# EAGLE design dresden_breakout_v03c (EAGLE 5.10)
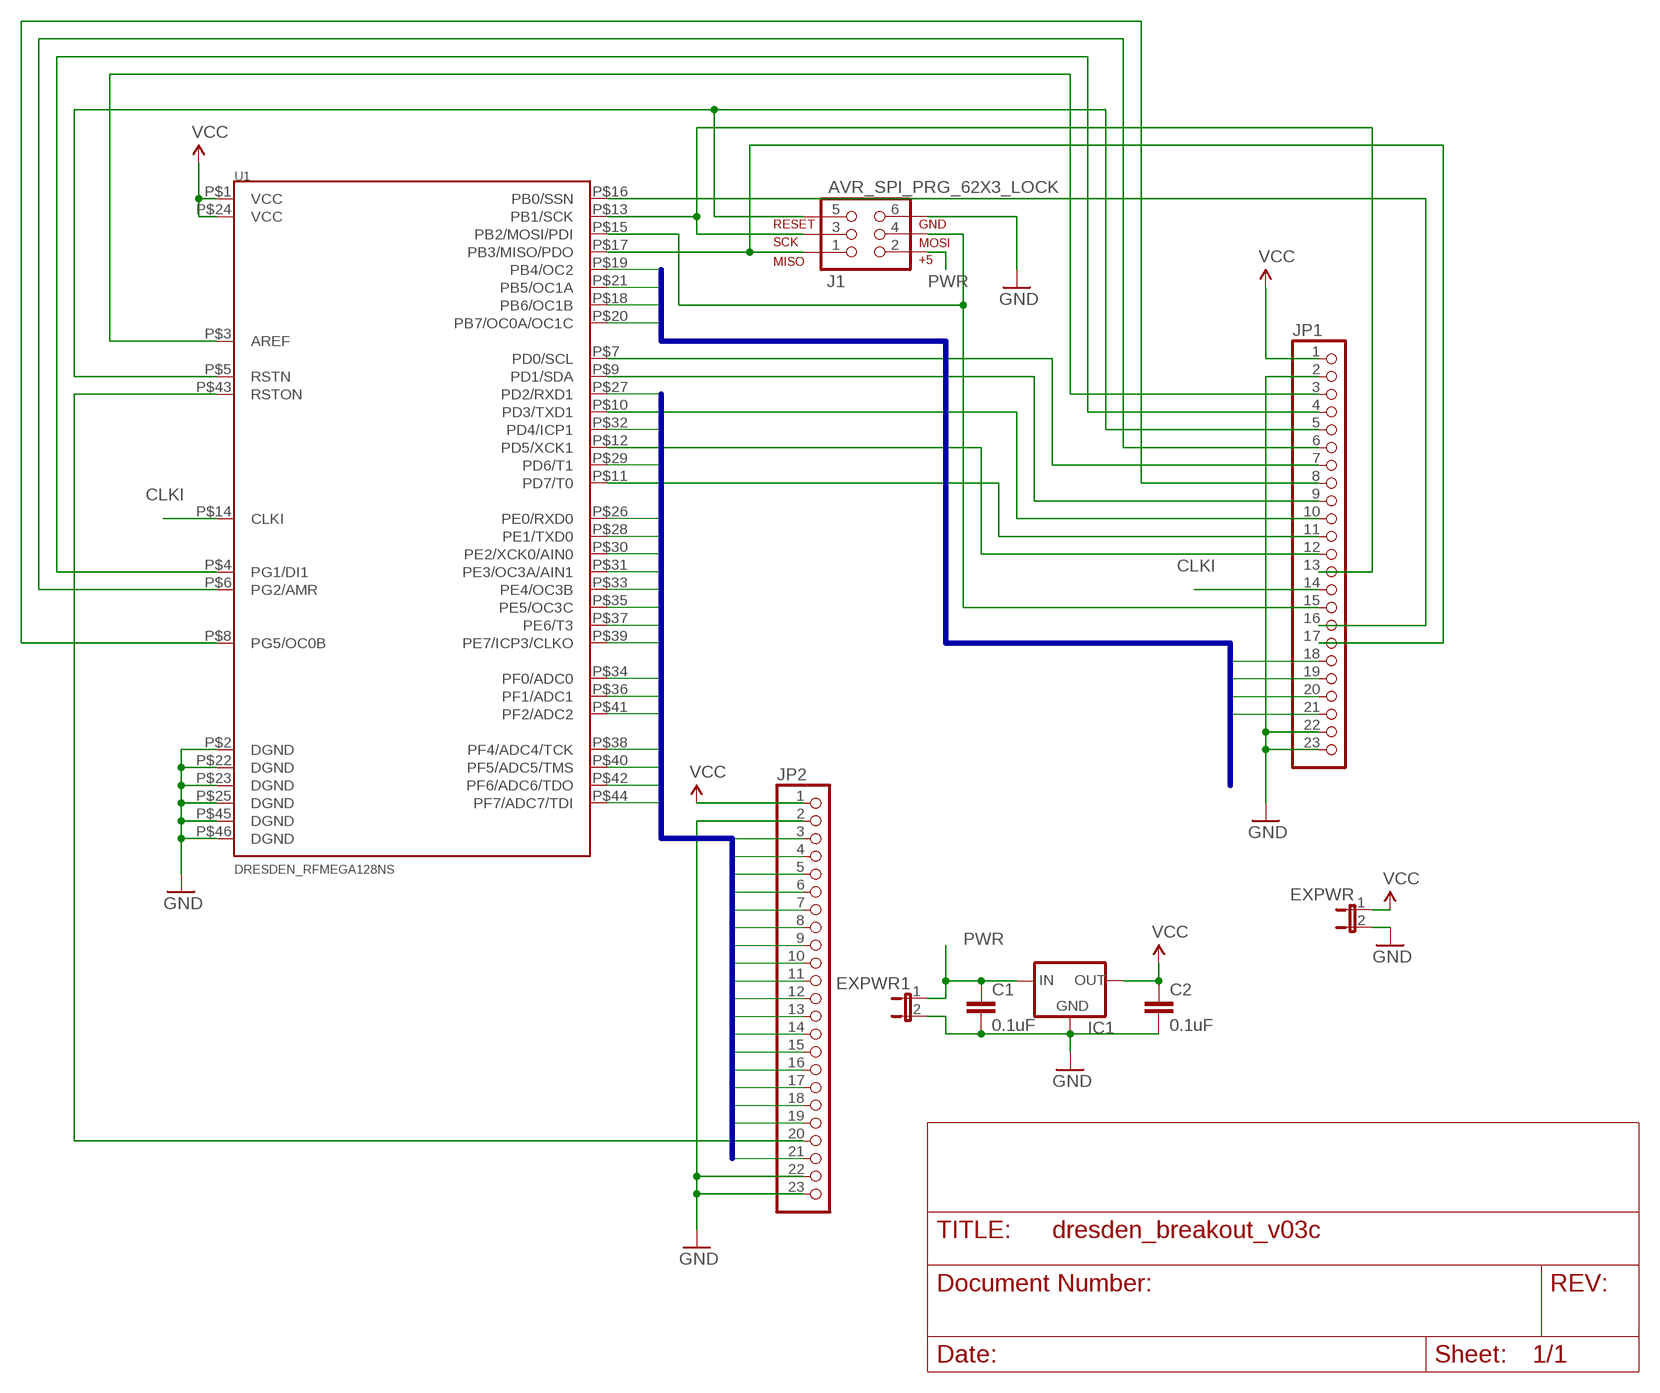
[diagram p0: schematic, sheet 1]

## Parts
C1  0.1uF  C-EU050-035X075  [C050-035X075]
C2  0.1uF  C-EU050-035X075  [C050-035X075]
EXPWR  JUMPER2  [JUMPER2]
EXPWR1  JUMPER2  [JUMPER2]
IC1  MCP1700INLINE  [TO92-INLINE]
J1  AVR_SPI_PRG_62X3_LOCK  [2X3_LOCK]
JP1  PINHD-1X23NS  [1X23-NS]
JP2  PINHD-1X23NS  [1X23-NS]
U1  DRESDEN_RFMEGA128NS  [DRESDEN-DERFMEGA128-NS]

## Nets
CLKI: JP1.14 U1.P$14(CLKI)
GND: C1.2 C2.2 EXPWR1.2 EXPWR.2 IC1.1(GND) J1.6 JP1.2 JP1.22 JP1.23 JP2.2 JP2.22 JP2.23 U1.P$2(DGND) U1.P$22(DGND) U1.P$23(DGND) U1.P$25(DGND) U1.P$45(DGND) U1.P$46(DGND)
MISO: J1.1 JP1.17 U1.P$17(PB3/MISO/PDO)
MOSI: J1.4 JP1.15 U1.P$15(PB2/MOSI/PDI)
N$1: JP1.7 U1.P$7(PD0/SCL)
N$2: JP1.12 U1.P$12(PD5/XCK1)
N$54: JP2.20 U1.P$43(RSTON)
N$65: JP1.9 U1.P$9(PD1/SDA)
N$66: JP1.3 U1.P$3(AREF)
N$67: JP1.4 U1.P$4(PG1/DI1)
N$68: JP1.6 U1.P$6(PG2/AMR)
N$69: JP1.8 U1.P$8(PG5/OC0B)
N$70: JP1.10 U1.P$10(PD3/TXD1)
N$72: JP1.11 U1.P$11(PD7/T0)
N$74: JP1.16 U1.P$16(PB0/SSN)
PIN18: JP1.18 U1.P$18(PB6/OC1B)
PIN19: JP1.19 U1.P$19(PB4/OC2)
PIN20: JP1.20 U1.P$20(PB7/OC0A/OC1C)
PIN21: JP1.21 U1.P$21(PB5/OC1A)
PIN26: JP2.3 U1.P$26(PE0/RXD0)
PIN27: JP2.4 U1.P$27(PD2/RXD1)
PIN28: JP2.5 U1.P$28(PE1/TXD0)
PIN29: JP2.6 U1.P$29(PD6/T1)
PIN30: JP2.7 U1.P$30(PE2/XCK0/AIN0)
PIN31: JP2.8 U1.P$31(PE3/OC3A/AIN1)
PIN32: JP2.9 U1.P$32(PD4/ICP1)
PIN33: JP2.10 U1.P$33(PE4/OC3B)
PIN34: JP2.11 U1.P$34(PF0/ADC0)
PIN35: JP2.12 U1.P$35(PE5/OC3C)
PIN36: JP2.13 U1.P$36(PF1/ADC1)
PIN37: JP2.14 U1.P$37(PE6/T3)
PIN38: JP2.15 U1.P$38(PF4/ADC4/TCK)
PIN39: JP2.16 U1.P$39(PE7/ICP3/CLKO)
PIN40: JP2.17 U1.P$40(PF5/ADC5/TMS)
PIN41: JP2.18 U1.P$41(PF2/ADC2)
PIN42: JP2.19 U1.P$42(PF6/ADC6/TDO)
PIN44: JP2.21 U1.P$44(PF7/ADC7/TDI)
PWR: C1.1 EXPWR1.1 IC1.2(IN) J1.2
RESET: J1.5 JP1.5 U1.P$5(RSTN)
SCK: J1.3 JP1.13 U1.P$13(PB1/SCK)
VCC: C2.1 EXPWR.1 IC1.3(OUT) JP1.1 JP2.1 U1.P$1(VCC) U1.P$24(VCC)

## Buses
PIN[18..21]
PIN[26..42],PIN44

## Library data of the parts
C1 C2 = rcl:C-EU: CAPACITOR, European symbol
EXPWR EXPWR1 = microbuilder:JUMPER2: JUMPER - 2 Pins
IC1 = adafruit:MCP1700: VOLTAGE REGULATOR
J1 = SparkFun:AVR_SPI_PRG_6: AVR ISP 6 Pin This is the reduced ISP connector for AVR programming. Common on Arduino. This footprint will take up less PCB space and can be used with a 10-pin to 6-pin adapter such as SKU: BOB-08508
JP1 JP2 = karlnet-parts:PINHD-1X23: PIN HEADER
U1 = karlnet-parts:DRESDEN_RFMEGA128: This is a modified ATmega128RFA1 part, to to match Dresden Elektronik's deRFmega128-22XX modules

## Board
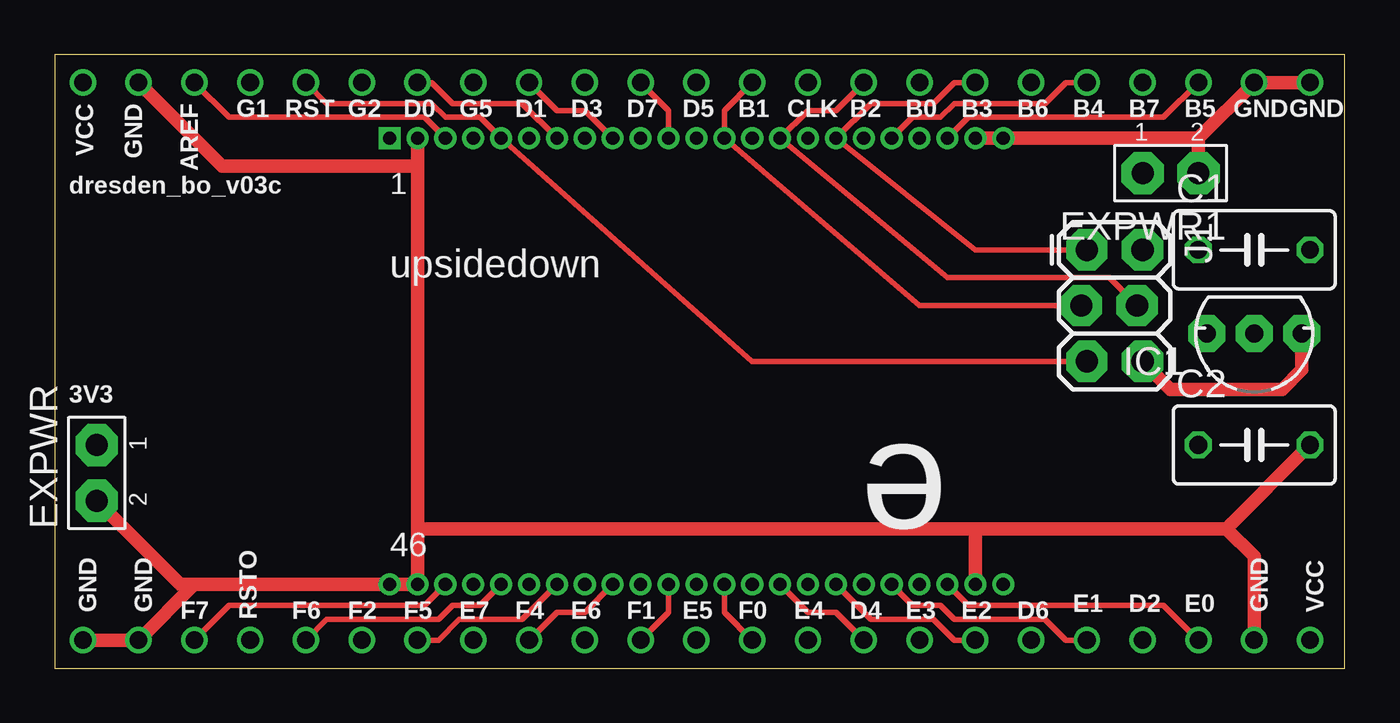
[diagram p1: board, top side]
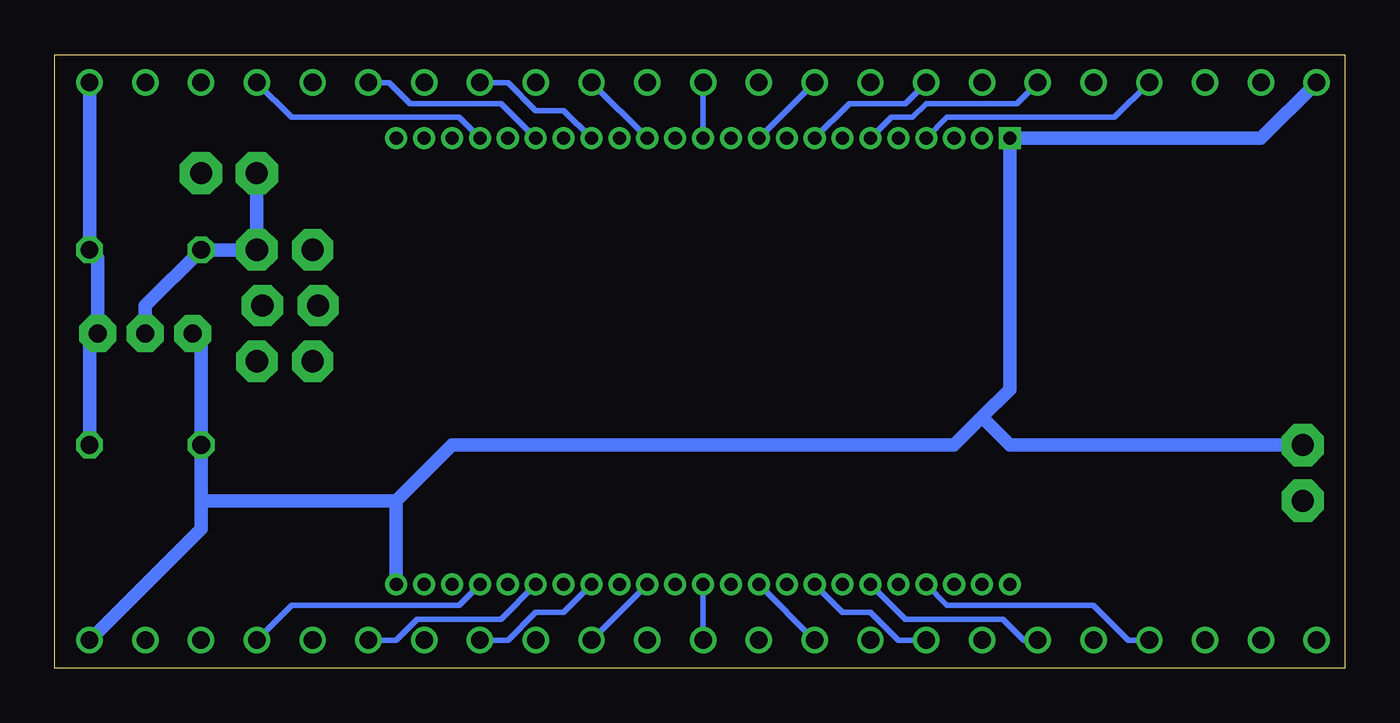
[diagram p2: board, bottom side, seen from below]

Size 58.72 x 27.93 mm. Coordinates in mm from the lower left corner, seen from the top.
Outline: 0,0 58.72,0 58.72,27.93 0,27.93 0,0
Copper layers (1*16): Top 0.0356mm / dielectric 1.5011mm / Bottom 0.0356mm
Design rules "dorkbot__LaenPCBOrder": minimum track width 6mil, minimum drill 13mil, track to track 6mil, track to pad 6mil, pad to pad 6mil, via to via 6mil, smd to smd 6mil, copper to edge 15mil, drill to drill 6mil, minimum pad ring 7mil, minimum via ring 7mil, stop-mask expansion 4mil, vias tented up to drill 0mil, thermal gap 10mil

### Footprints (pad centres in the part's own frame; a part is rotated, then mirrored left to right if it is on the bottom)
C050-035X075 = drill 0.813 octagon: 1 -2.54,0; 2 2.54,0
JUMPER2 = drill 1 pad 1.93 octagon: 1 2.54,0; 2 0,0
TO92-INLINE = drill 0.813 pad 1.676 octagon: 1 -2.159,0; 2 0,0; 3 2.159,0
2X3_LOCK = drill 1.016 pad 1.88 octagon: 1 0,0; 2 0,2.54; 3 2.54,-0.254; 4 2.54,2.286; 5 5.08,0; 6 5.08,2.54
1X23-NS = drill 0.8 round: 1 0,0; 2 2.54,0; 3 5.08,0; 4 7.62,0; 5 10.16,0; 6 12.7,0; 7 15.24,0; 8 17.78,0; 9 20.32,0; 10 22.86,0; 11 25.4,0; 12 27.94,0; 13 30.48,0; 14 33.02,0; 15 35.56,0; 16 38.1,0; 17 40.64,0; 18 43.18,0; 19 45.72,0; 20 48.26,0; 21 50.8,0; 22 53.34,0; 23 55.88,0
DRESDEN-DERFMEGA128-NS = drill 0.6 pad 1.006 square: P$1 -13.97,10.16 | drill 0.6 pad 1.006 round: P$2 -12.7,10.16; P$3 -11.43,10.16; P$4 -10.16,10.16; P$5 -8.89,10.16; P$6 -7.62,10.16; P$7 -6.35,10.16; P$8 -5.08,10.16; P$9 -3.81,10.16; P$10 -2.54,10.16; P$11 -1.27,10.16; P$12 0,10.16; P$13 1.27,10.16; P$14 2.54,10.16; P$15 3.81,10.16; P$16 5.08,10.16; P$17 6.35,10.16; P$18 7.62,10.16; P$19 8.89,10.16; P$20 10.16,10.16; P$21 11.43,10.16; P$22 12.7,10.16; P$23 13.97,10.16; P$24 13.97,-10.16; P$25 12.7,-10.16; P$26 11.43,-10.16; P$27 10.16,-10.16; P$28 8.89,-10.16; P$29 7.62,-10.16; P$30 6.35,-10.16; P$31 5.08,-10.16; P$32 3.81,-10.16; P$33 2.54,-10.16; P$34 1.27,-10.16; P$35 0,-10.16; P$36 -1.27,-10.16; P$37 -2.54,-10.16; P$38 -3.81,-10.16; P$39 -5.08,-10.16; P$40 -6.35,-10.16; P$41 -7.62,-10.16; P$42 -8.89,-10.16; P$43 -10.16,-10.16; P$44 -11.43,-10.16; P$45 -12.7,-10.16; P$46 -13.97,-10.16

### Placement (x,y rotation side)
C1  54.61,19.05 0 top
C2  54.61,10.16 0 top
EXPWR  1.9,7.62 90 top
EXPWR1  52.07,22.54 180 top
IC1  54.61,15.24 180 top
J1  46.99,19.05 270 top
JP1  1.27,26.67 0 top
JP2  57.15,1.27 180 top
U1  29.21,13.97 0 top

### Tracks (layer width: path | path; a pad name or v marks a point on that pad's centre or on a via)
CLKI
  Bottom 0.254: U1.P$14 JP1.14
GND
  Top 0.61: 41.91,6.35 U1.P$25 | U1.P$22 U1.P$23 52.07,24.13 | 16.51,6.35 U1.P$45 U1.P$46 6.35,3.81 | 16.51,6.35 41.91,6.35 | 16.51,6.35 16.51,22.86 | 16.51,22.86 U1.P$2 | J1.6 50.8,12.7 55.88,12.7 56.77,13.59 IC1.1 | JP1.23 JP1.22 52.07,24.13 | JP2.23 JP2.22 6.35,3.81 | 16.51,22.86 7.62,22.86 JP1.2 | 52.07,24.13 EXPWR1.2 | 41.91,6.35 53.34,6.35 | 53.34,6.35 C2.2 | JP2.2 54.61,5.08 53.34,6.35 | EXPWR.2 5.71,3.81 6.35,3.81
  Bottom 0.61: C2.2 57.15,14.86 IC1.1 56.77,18.67 C1.2 JP1.23
MISO
  Top 0.254: J1.1 41.91,19.05 U1.P$17 37.15,25.72 40,25.72 40.96,26.67 JP1.17
MOSI
  Top 0.254: J1.4 48.01,17.78 40.64,17.78 U1.P$15 34.29,25.4 35.56,25.4 JP1.15
N$1
  Top 0.254: U1.P$7 21.27,25.72 18.1,25.72 17.14,26.67 JP1.7
N$2
  Bottom 0.254: U1.P$12 JP1.12
N$54
  Bottom 0.254: JP2.20 9.84,1.27 11.43,2.86 18.1,2.86 U1.P$43
N$65
  Top 0.254: U1.P$9 24.13,25.4 22.86,25.4 JP1.9
N$66
  Top 0.254: U1.P$3 16.83,25.08 7.94,25.08 JP1.3
N$67
  Bottom 0.254: U1.P$4 18.1,25.08 10.48,25.08 JP1.4
N$68
  Bottom 0.254: U1.P$6 20.64,25.08 19.68,25.08 19.05,25.72 14.92,25.72 JP1.6
N$69
  Bottom 0.254: U1.P$8 22.54,25.72 20,25.72 JP1.8
N$70
  Bottom 0.254: JP1.10 U1.P$10
N$72
  Top 0.254: U1.P$11 27.94,25.4 JP1.11
N$74
  Bottom 0.254: JP1.16 38.1,26.67 36.83,25.4 35.56,25.4 U1.P$16
PIN18
  Bottom 0.254: JP1.18 43.5,26.67 42.54,25.72 38.42,25.72 U1.P$18
PIN19
  Top 0.254: U1.P$19 39.05,25.08 40.32,25.08 40.96,25.72 45.08,25.72 46.04,26.67 JP1.19
PIN20
  Bottom 0.254: U1.P$20 40.32,25.08 47.94,25.08 JP1.20
PIN21
  Top 0.254: U1.P$21 41.59,25.08 50.48,25.08 JP1.21
PIN26
  Top 0.254: U1.P$26 41.59,2.86 50.48,2.86 JP2.3
PIN27
  Bottom 0.254: U1.P$27 40.32,2.86 47.94,2.86 JP2.4
PIN28
  Top 0.254: U1.P$28 39.05,2.86 40.32,2.86 40.96,2.22 45.08,2.22 46.04,1.27 JP2.5
PIN29
  Bottom 0.254: U1.P$29 38.42,2.22 42.23,2.22 43.18,1.27 JP2.6
PIN30
  Top 0.254: U1.P$30 37.15,2.22 40,2.22 40.96,1.27 JP2.7
PIN31
  Bottom 0.254: JP2.8 38.1,1.27 36.83,2.54 35.56,2.54 U1.P$31
PIN32
  Top 0.254: U1.P$32 34.29,2.54 35.56,2.54 JP2.9
PIN33
  Bottom 0.254: JP2.10 U1.P$33
PIN34
  Top 0.254: U1.P$34 30.48,2.54 JP2.11
PIN35
  Bottom 0.254: JP2.12 U1.P$35
PIN36
  Top 0.254: U1.P$36 27.94,2.54 JP2.13
PIN37
  Bottom 0.254: JP2.14 U1.P$37
PIN38
  Top 0.254: U1.P$38 24.13,2.54 22.86,2.54 JP2.15
PIN39
  Bottom 0.254: U1.P$39 22.86,2.54 21.59,2.54 20.32,1.27 JP2.16
PIN40
  Top 0.254: U1.P$40 21.27,2.22 18.41,2.22 17.46,1.27 JP2.17
PIN41
  Bottom 0.254: JP2.18 14.61,1.27 15.56,2.22 20,2.22 U1.P$41
PIN42
  Top 0.254: U1.P$42 19.37,2.86 18.1,2.86 17.46,2.22 12.38,2.22 JP2.19
PIN44
  Top 0.254: U1.P$44 16.83,2.86 7.94,2.86 JP2.21
PWR
  Bottom 0.61: IC1.2 54.61,16.51 C1.1 J1.2 EXPWR1.1
RESET
  Top 0.254: J1.5 31.75,13.97 U1.P$5 19.37,25.08 17.78,25.08 17.14,25.72 12.38,25.72 JP1.5
SCK
  Top 0.254: J1.3 39.37,16.51 U1.P$13 30.48,25.4 JP1.13
VCC
  Bottom 0.61: IC1.3 52.07,14.86 C2.1 52.07,7.62 | 16.51,11.43 15.24,12.7 U1.P$1 3.81,24.13 JP1.1 | 16.51,11.43 17.78,10.16 40.64,10.16 43.18,7.62 | 43.18,7.62 U1.P$24 | 52.07,7.62 52.07,6.35 JP2.1 | 43.18,7.62 52.07,7.62 | EXPWR.1 15.24,10.16 16.51,11.43

### Text on the board
tPlace: VCC | GND | AREF | G1 | RST | G2 | D0 | G5 | D1 | D3 | D7 | D5 | B1 | CLK | B2 | B0 | B3 | B6 | B4 | B7 | B5 | GND | GND | dresden_bo_v03c | 3V3 | GND | GND | E1 | D2 | E0 | GND | VCC | F7 | RSTO | F6 | F2 | F5 | E7 | F4 | E6 | F1 | E5 | F0 | E4 | D4 | E3 | E2 | D6